# EAGLE design XStepper Opto-Isolator ADuM1301 v002 (EAGLE 6.4)
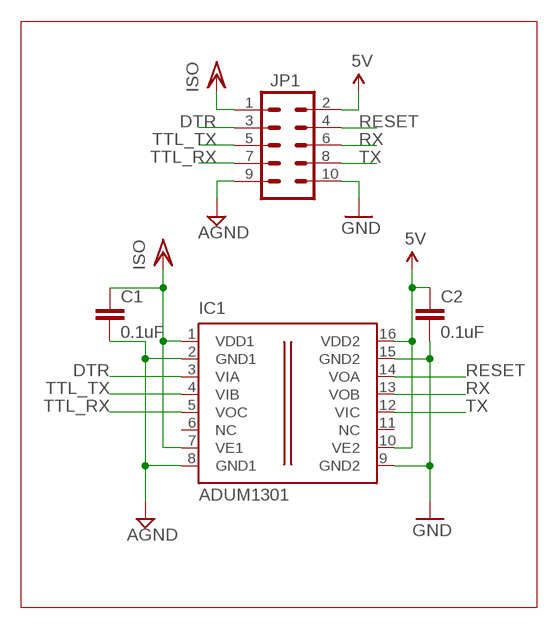
[diagram p0: schematic, sheet 1]

## Parts
C1  0.1uF  CAP0805  [0805]
C2  0.1uF  CAP0805  [0805]
IC1  ADUM1301  [SO-16W]
JP1  M05X2PTH  [AVR_ICSP]

## Nets
5V: C2.1 IC1.10(VE2) IC1.16(VDD2) JP1.2
AGND [power]: C1.2 IC1.2(GND1) IC1.8(GND1) JP1.9
DTR: IC1.3(VIA) JP1.3
GND [power]: C2.2 IC1.9(GND2) IC1.15(GND2) JP1.10
RESET: IC1.14(VOA) JP1.4
RX: IC1.13(VOB) JP1.6
TTL_RX: IC1.5(VOC) JP1.7
TTL_TX: IC1.4(VIB) JP1.5
TX: IC1.12(VIC) JP1.8
VCC/2: C1.1 IC1.1(VDD1) IC1.7(VE1) JP1.1 ; supply symbol labelled ISO
Unconnected: IC1.6(NC) IC1.11(NC)

## Library data of the parts
C1 C2 = SparkFun-Capacitors:CAP: Capacitor Standard 0603 ceramic capacitor, and 0.1" leaded capacitor.
IC1 = analog-devices:ADUM1301: Triple-Channel Digital Isolators Source: http://www.analog.com/static/imported-files/data_sheets/ADuM1300_1301.pdf; MPN: ADUM1301BRWZ; OC_FARNELL: 1465623; OC_NEWARK: 19M0757
JP1 = SparkFun-Connectors:M05X2: Header 5x2 Standard 10-pin dual row 0.1" header. Commonly used with AVR-ISP. Use with Spark Fun Electronics SKU: PRT-00778

## Net classes
0 default: width 0.254 mm, clearance 0.355 mm
1 power: width 1.016 mm, clearance 0.355 mm to class 0, clearance 0.355 mm

## Board
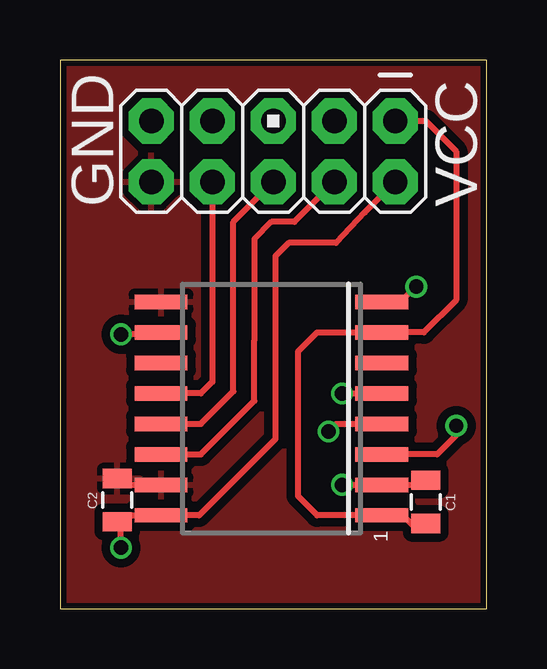
[diagram p1: board, top side]
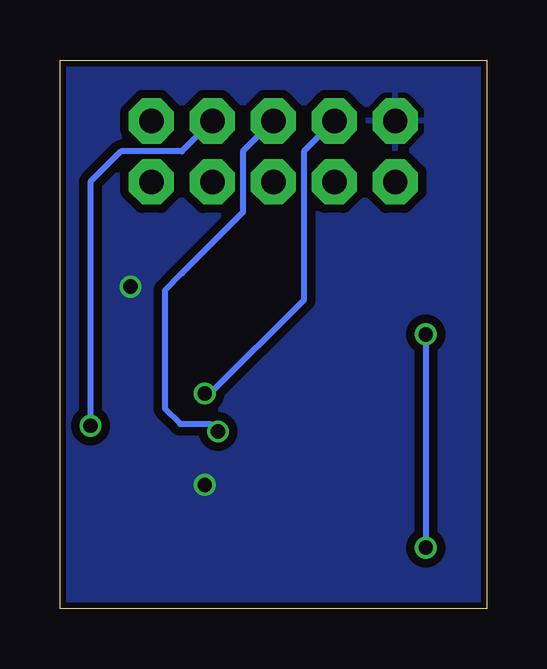
[diagram p2: board, bottom side, seen from below]

Size 17.78 x 22.86 mm. Coordinates in mm from the lower left corner, seen from the top.
Outline: 0,0 17.78,0 17.78,22.86 0,22.86 0,0
Copper layers (1*16): Top 0.035mm / dielectric 1.5mm / Bottom 0.035mm
Design rules "ITEADstudio_DRC": minimum track width 6mil, minimum drill 12mil, track to track 6mil, track to pad 6mil, pad to pad 6mil, via to via 6mil, smd to smd 0mil, copper to edge 10mil, drill to drill 10mil, minimum pad ring 10mil, minimum via ring 6mil, stop-mask expansion 2mil, vias tented up to drill 100mil, thermal gap 10mil

### Footprints (pad centres in the part's own frame; a part is rotated, then mirrored left to right if it is on the bottom)
0805 = smd 0.8 x 1.2: 1 -0.9,0; 2 0.9,0
SO-16W = smd 0.6 x 2.2: 1 -4.445,-4.6; 2 -3.175,-4.6; 3 -1.905,-4.6; 4 -0.635,-4.6; 5 0.635,-4.6; 6 1.905,-4.6; 7 3.175,-4.6; 8 4.445,-4.6; 9 4.445,4.6; 10 3.175,4.6; 11 1.905,4.6; 12 0.635,4.6; 13 -0.635,4.6; 14 -1.905,4.6; 15 -3.175,4.6; 16 -4.445,4.6
AVR_ICSP = drill 1.016 pad 1.88 octagon: 1 -1.27,5.08; 2 1.27,5.08; 3 -1.27,2.54; 4 1.27,2.54; 5 -1.27,0; 6 1.27,0; 7 -1.27,-2.54; 8 1.27,-2.54; 9 -1.27,-5.08; 10 1.27,-5.08

### Placement (x,y rotation side)
C1  15.24,4.45 90 top
C2  2.38,4.52 90 top
IC1  8.81,8.33 90 top
JP1  8.89,19.05 270 top

### Tracks (layer width: path | path; a pad name or v marks a point on that pad's centre or on a via)
5V  (via drill 0.6)
  Top 0.254: JP1.2 12.7,16.51 11.51,15.24 9.53,15.24 8.97,14.68 8.97,12.78 8.97,7.06 5.79,3.89 5.08,3.89 | 5.08,3.89 4.76,3.89 | 5.08,3.89 IC1.16 2.65,3.89 C2.1 2.54,3.47 v2.54,2.54 | IC1.10 4.13,11.43 v2.54,11.43
  Bottom 0.254: v2.54,11.43 v2.54,2.54
AGND  (via drill 0.6)
  Top 0.254: v11.75,5.16 IC1.2 15.05,5.16 C1.2 | IC1.8 14.21,12.78 v14.84,13.41
  pour Bottom: 0,0 17.78,0 17.78,22.86 -1.27,22.86 -1.27,0
DTR  (via drill 0.6)
  Top 0.254: v16.51,7.62 16.51,7.22 15.72,6.43 IC1.3
  Bottom 0.254: JP1.3 12.7,19.05 15.24,19.05 16.51,17.78 v16.51,7.62
GND
  Top 0.254: C2.2 2.65,5.16 IC1.15
  pour Top: 0,0 19.05,0 19.05,22.86 0,22.86
RESET
  Top 0.254: IC1.14 5.87,6.43 8.1,8.65 8.1,11.19 8.1,14.45 8.1,15.4 8.81,16.11 9.76,16.11 JP1.4
RX
  Top 0.254: IC1.13 5.87,7.7 7.22,9.05 7.22,16.11 JP1.6
TTL_RX  (via drill 0.6)
  Top 0.254: v11.75,8.97 IC1.5
  Bottom 0.254: JP1.7 7.62,19.05 7.62,12.86 11.51,8.97 v11.75,8.97
TTL_TX  (via drill 0.6)
  Top 0.254: v11.19,7.38 11.51,7.7 IC1.4
  Bottom 0.254: JP1.5 10.16,19.05 10.16,16.51 12.7,13.97 13.41,13.26 13.41,8.33 12.78,7.7 11.51,7.7 v11.19,7.38
TX
  Top 0.254: JP1.8 6.35,10.16 6.35,9.45 5.87,8.97 IC1.12
VCC/2
  Top 0.254: 12.7,3.89 IC1.1 14.29,3.89 14.76,3.41 15.11,3.41 C1.1 | 12.7,3.89 10.72,3.89 9.92,4.68 9.92,10.72 10.72,11.51 IC1.7 15.16,11.51 16.51,12.86 16.51,19.05 15.24,20.32 JP1.1 | 12.54,3.73 12.7,3.89

### Text on the board
tNames: GND | VCC | 1